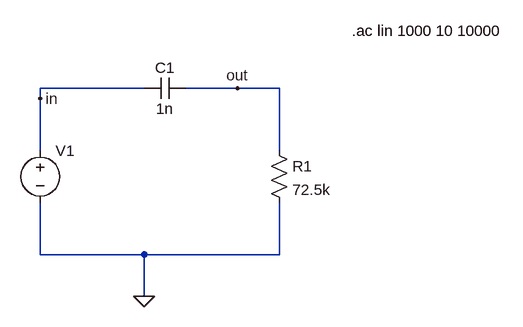
[diagram p0: schematic PassaAlta.asc]
PassaAlta.asc, the LTspice schematic file:
Version 4
SHEET 1 880 680
WIRE 112 176 -48 176
WIRE 256 176 176 176
WIRE 320 176 256 176
WIRE -48 192 -48 176
WIRE -48 272 -48 192
WIRE 320 272 320 176
WIRE -48 432 -48 352
WIRE 112 432 -48 432
WIRE 320 432 320 352
WIRE 320 432 112 432
WIRE 112 496 112 432
FLAG 112 496 0
FLAG 256 176 out
FLAG -48 192 in
SYMBOL voltage -48 256 R0
SYMATTR InstName V1
SYMATTR Value ""
SYMATTR Value2 AC 10
SYMBOL res 304 256 R0
SYMATTR InstName R1
SYMATTR Value 72.5k
SYMBOL cap 176 160 R90
WINDOW 0 0 32 VBottom 2
WINDOW 3 32 32 VTop 2
SYMATTR InstName C1
SYMATTR Value 1n
TEXT 432 88 Left 2 !.ac lin 1000 10 10000

The netlist it stands for:
* PassaAlta.asc
V1 in 0 AC 10
R1 out 0 72.5k
C1 out in 1n
.ac lin 1000 10 10000
.backanno
.end